# Altium schematic sheet Board-ADC.SchDoc: =ProjectTitle
size 297 x 209 mm; Address1: Address1; Address2: Address2; Address3: Address3; Address4: Address4; SheetNumber: 6; SheetTotal: 6; Scale: 1:1; DocumentType: Схема электрическая принципиальная
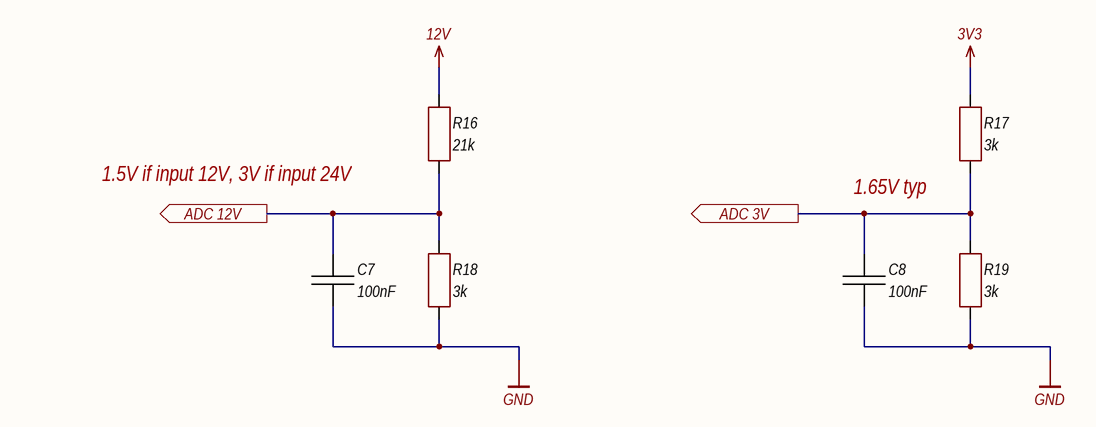
[diagram p0: Board-ADC.SchDoc]

## Parts
C7  100nF  [CH0402C]
C8  100nF  [CH0402C]
R16  21k  [CH0402R]
R17  3k  [CH0402R]
R18  3k  [CH0402R]
R19  3k  [CH0402R]

## Ports
ADC 3V (out), ADC 12V (out)

## Nets
3V3: R17.2
12V: R16.2
GND: C7.1 C8.1 R18.1 R19.1
ADC 3V: C8.2 R17.1 R19.2 ; port ADC 3V
ADC 12V: C7.2 R16.1 R18.2 ; port ADC 12V

## Notes on the sheet
- (near R16) 1.5V if input 12V, 3V if input 24V
- (near R17) 1.65V typ
- Изм.
- Лист
- № докум.
- Подп.
- Дата
- Копировал
- Формат А4

## Library data of the parts
C7 C8 = Capacitor: Manufacturer: CCTC; Model: TCC0402X7R104K250AT; HelpURL: https://lcsc.com/product-detail/Multilayer-Ceramic-Capacitors-MLCC-SMD-SMT_CCTC-TCC0402X7R104K250AT_C466234.html; ComponentKind: X7R, 50V; Value: 100nF
R16 = Resistor: Manufacturer: Uniroyal Elec; Model: 0402WGF2102TCE; HelpURL: https://lcsc.com/product-detail/Chip-Resistor-Surface-Mount_UNI-ROYAL-Uniroyal-Elec-0402WGF2102TCE_C25766.html; ComponentKind: ±1%; Value: 21k
R17-R19 = Resistor: Manufacturer: Uniroyal Elec; Model: 0402WGF3001TCE; HelpURL: https://lcsc.com/product-detail/Chip-Resistor-Surface-Mount_UNI-ROYAL-Uniroyal-Elec-0402WGF3001TCE_C25784.html; ComponentKind: ±1%; Value: 3k